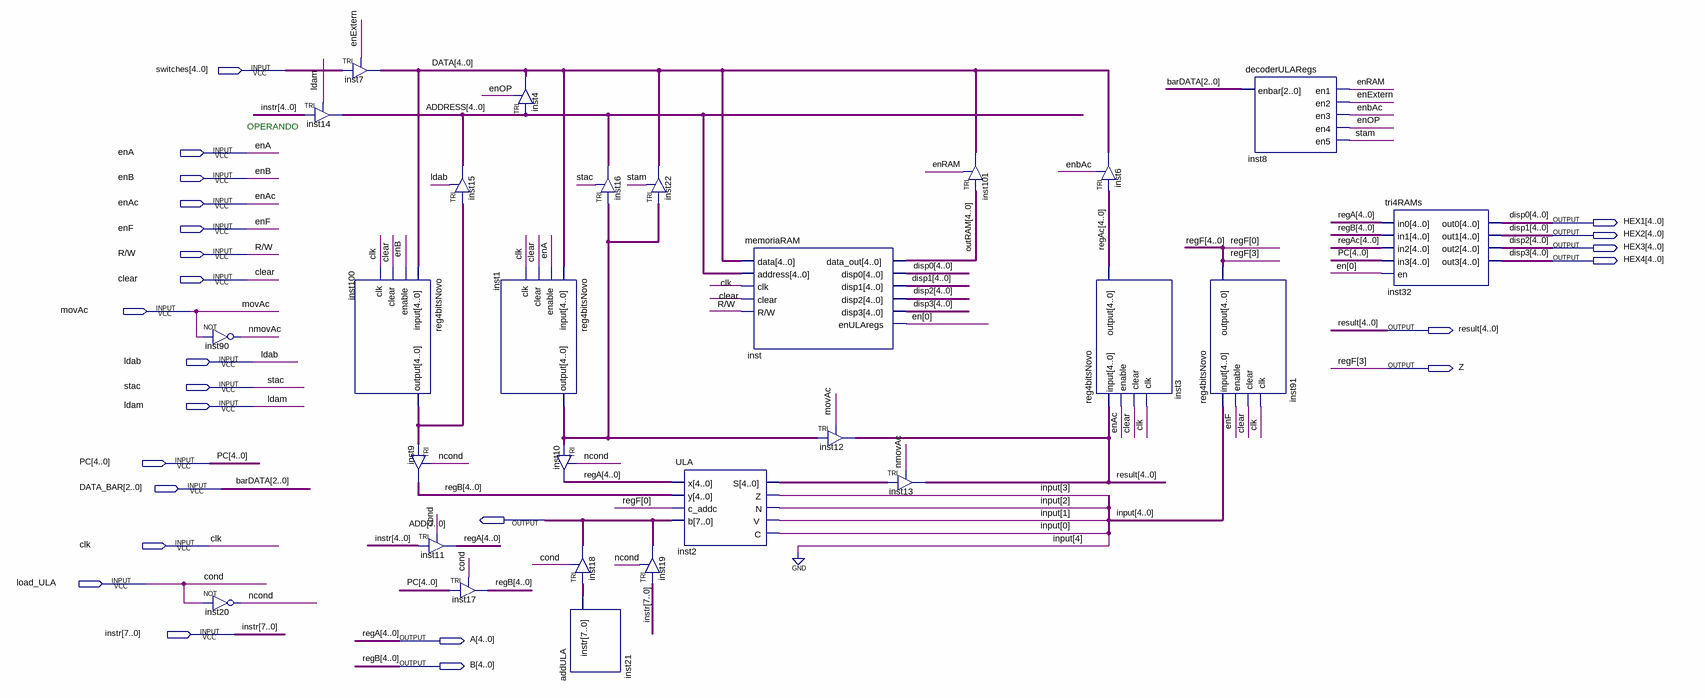
[diagram p0: schematic sheet]
// Quartus schematic circuitoRegsULA(1).bdf as structural Verilog: 27 symbols, 25 pins
module \circuitoRegsULA(1)  (
  input  [4:0] switches,
  input  enA,
  input  enB,
  input  enAc,
  input  enF,
  input  \R/W ,
  input  clear,
  input  movAc,
  input  ldab,
  input  stac,
  input  ldam,
  input  [4:0] PC,
  input  [2:0] DATA_BAR,
  input  clk,
  input  load_ULA,
  input  [7:0] instr,
  output [4:0] HEX1,
  output [4:0] HEX2,
  output [4:0] HEX3,
  output [4:0] HEX4,
  output [4:0] result,
  output Z,
  output [7:0] ADD,
  output [4:0] A,
  output [4:0] B
);

  wire enbAc, enExtern, enOP, enRAM, ncond, nmovAc, stam;
  wire [0:0] en;
  wire [3:0] \input ;
  wire [4:0] ADDRESS, DATA, inst1_output, inst2_s, inst100_output, outRAM, regAc, regF;
  wire [7:0] inst21_instr;

  not inst90 (nmovAc, movAc);
  not inst20 (ncond, load_ULA);
  TRI inst14[4:0] (.IN(instr[4:0]), .OE(ldam), .OUT(ADDRESS));
  TRI inst7[4:0] (.IN(switches), .OE(enExtern), .OUT(DATA));
  reg4bitsNovo inst100 (.\input (DATA), .enable(enB), .clear(clear), .clk(clk), .\output (inst100_output));
  TRI inst9[4:0] (.IN(inst100_output), .OE(ncond), .OUT(B));
  TRI inst11[4:0] (.IN(instr[4:0]), .OE(load_ULA), .OUT(A));
  TRI inst15[4:0] (.IN(inst100_output), .OE(ldab), .OUT(ADDRESS));
  reg4bitsNovo inst1 (.\input (DATA), .enable(enA), .clear(clear), .clk(clk), .\output (inst1_output));
  TRI inst17[4:0] (.IN(PC), .OE(load_ULA), .OUT(B));
  TRI inst4[4:0] (.IN(ADDRESS), .OE(enOP), .OUT(DATA));
  TRI inst10[4:0] (.IN(inst1_output), .OE(ncond), .OUT(A));
  TRI inst18[7:0] (.IN(inst21_instr), .OE(load_ULA), .OUT(ADD));
  addULA inst21 (.instr(inst21_instr));
  TRI inst16[4:0] (.IN(inst1_output), .OE(stac), .OUT(ADDRESS));
  TRI inst19[7:0] (.IN(instr), .OE(ncond), .OUT(ADD));
  TRI inst22[4:0] (.IN(inst1_output), .OE(stam), .OUT(DATA));
  ULA inst2 (
    .x(A), .y(B), .c_addc(regF[0]), .b(ADD), .S(inst2_s), .Z(\input [3]), .N(\input [2]), .V(\input [1]),
    .C(\input [0]));
  memoriaRAM inst (
    .data(DATA), .address(ADDRESS), .clk(clk), .clear(clear), .\R/W (\R/W ), .data_out(outRAM), .disp0(HEX1),
    .disp1(HEX2), .disp2(HEX3), .disp3(HEX4), .enULAregs(en[0]));
  TRI inst12[4:0] (.IN(inst1_output), .OE(movAc), .OUT(result));
  TRI inst13[4:0] (.IN(inst2_s), .OE(nmovAc), .OUT(result));
  TRI inst101[4:0] (.IN(outRAM), .OE(enRAM), .OUT(DATA));
  TRI inst6[4:0] (.IN(regAc), .OE(enbAc), .OUT(DATA));
  reg4bitsNovo inst3 (.\input (result), .enable(enAc), .clear(clear), .clk(clk), .\output (regAc));
  reg4bitsNovo inst91 (
    .\input ({1'b0, \input }), .enable(enF), .clear(clear), .clk(clk), .\output ({regF[4], Z, regF[2:0]}));
  decoderULARegs inst8 (.enbar(DATA_BAR), .en1(enRAM), .en2(enExtern), .en3(enbAc), .en4(enOP), .en5(stam));
  tri4RAMs inst32 (
    .in0(A), .in1(B), .in2(regAc), .in3(PC), .en(en[0]), .out0(HEX1), .out1(HEX2), .out2(HEX3), .out3(HEX4));

  // Other names for the same wires on the sheet: barDATA[2:0] = DATA_BAR; cond = load_ULA; disp0[4:0] = HEX1;
  //   disp1[4:0] = HEX2; disp2[4:0] = HEX3; disp3[4:0] = HEX4; regA[4:0] = A; regB[4:0] = B; regF[3] = Z

  // Notes on the sheet:
  //   OPERANDO
endmodule
